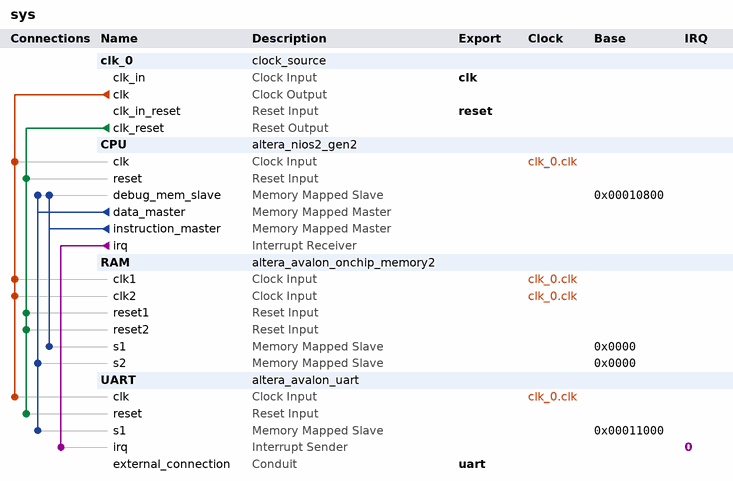
[diagram p0: system contents]
# Platform Designer (Qsys) system sys, Cyclone IV E EP4CE10F17C8
# Parameters at their usual value, and those the tool derives, are not listed.
package require -exact qsys 22.1
create_system sys
set_project_property DEVICE_FAMILY {Cyclone IV E}
set_project_property DEVICE EP4CE10F17C8

add_instance clk_0 clock_source 22.1
set_instance_parameter_value clk_0 clockFrequency 50000000

add_instance CPU altera_nios2_gen2 22.1
set_instance_parameter_value CPU dcache_size 2048
set_instance_parameter_value CPU exceptionSlave RAM.s1
set_instance_parameter_value CPU icache_size 4096
set_instance_parameter_value CPU impl Tiny
set_instance_parameter_value CPU resetSlave RAM.s1

add_instance RAM altera_avalon_onchip_memory2 22.1
set_instance_parameter_value RAM dataWidth 32
set_instance_parameter_value RAM dualPort true
set_instance_parameter_value RAM initMemContent true
set_instance_parameter_value RAM initializationFileName onchip_mem.hex
set_instance_parameter_value RAM memorySize 41000

add_instance UART altera_avalon_uart 22.1
set_instance_parameter_value UART baud 115200
set_instance_parameter_value UART dataBits 8
set_instance_parameter_value UART fixedBaud true
set_instance_parameter_value UART parity NONE
set_instance_parameter_value UART stopBits 1

# connections
add_connection clk_0.clk CPU.clk clock
add_connection clk_0.clk RAM.clk1 clock
add_connection clk_0.clk RAM.clk2 clock
add_connection clk_0.clk UART.clk clock
add_connection clk_0.clk_reset CPU.reset reset
add_connection clk_0.clk_reset RAM.reset1 reset
add_connection clk_0.clk_reset RAM.reset2 reset
add_connection clk_0.clk_reset UART.reset reset
add_connection CPU.data_master CPU.debug_mem_slave avalon
set_connection_parameter_value CPU.data_master/CPU.debug_mem_slave baseAddress 0x00010800
add_connection CPU.data_master RAM.s2 avalon
set_connection_parameter_value CPU.data_master/RAM.s2 baseAddress 0x0000
add_connection CPU.data_master UART.s1 avalon
set_connection_parameter_value CPU.data_master/UART.s1 baseAddress 0x00011000
add_connection CPU.instruction_master CPU.debug_mem_slave avalon
set_connection_parameter_value CPU.instruction_master/CPU.debug_mem_slave baseAddress 0x00010800
add_connection CPU.instruction_master RAM.s1 avalon
set_connection_parameter_value CPU.instruction_master/RAM.s1 baseAddress 0x0000
add_connection CPU.irq UART.irq interrupt
set_connection_parameter_value CPU.irq/UART.irq irqNumber 0

# exported interfaces
add_interface clk clock sink
set_interface_property clk EXPORT_OF clk_0.clk_in
add_interface reset reset sink
set_interface_property reset EXPORT_OF clk_0.clk_in_reset
add_interface uart conduit end
set_interface_property uart EXPORT_OF UART.external_connection

set_interconnect_requirement {$system} qsys_mm.clockCrossingAdapter HANDSHAKE
set_interconnect_requirement {$system} qsys_mm.enableEccProtection FALSE
set_interconnect_requirement {$system} qsys_mm.insertDefaultSlave FALSE
set_interconnect_requirement {$system} qsys_mm.maxAdditionalLatency 1

save_system sys.qsys
